# EasyEDA Pro project ProPrj_主板_2025-09-13.epro

# Schematic Schematic1
Board Name: Board1; Create Date: 2025-09-09; Page Name: P1; Project Name: 主板; Schematic Name: Schematic1; Update Date: 2025-09-12; Company: 嘉立创EDA; Page Size: A4; Version: V1.0
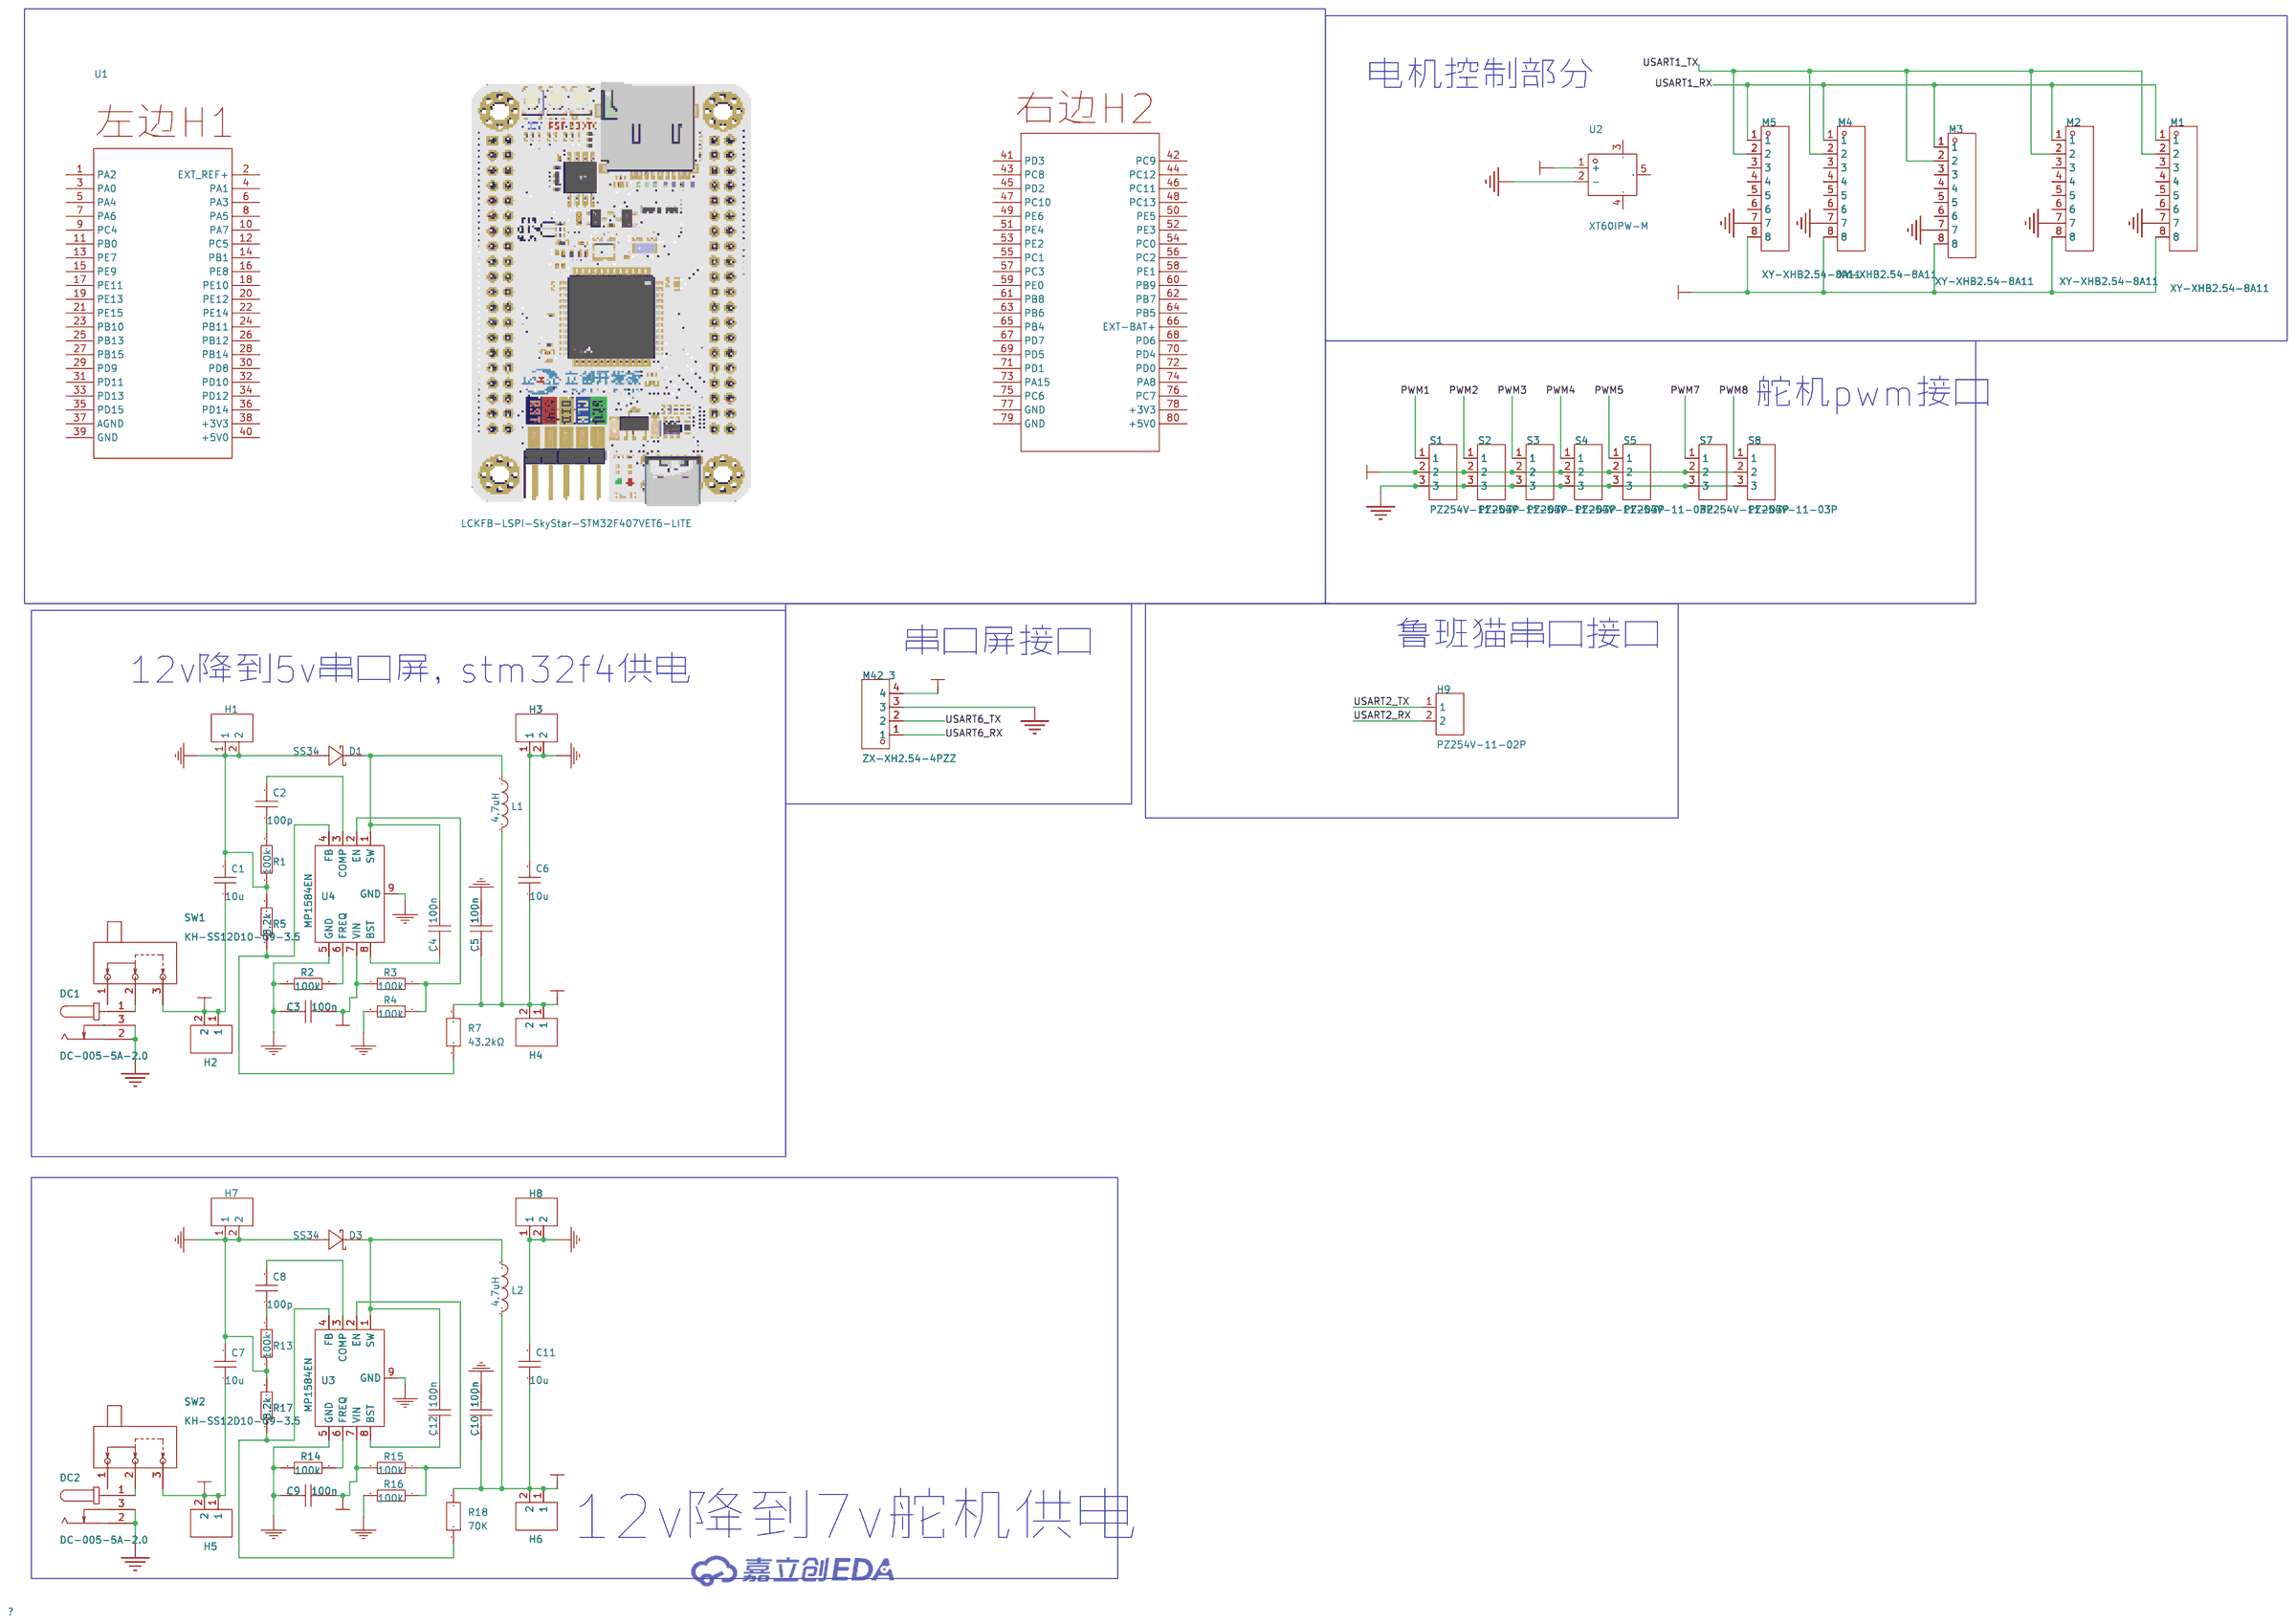
[diagram p0: schematic sheet]

## Parts
C1  10u  [C1206]
C2  100p  [C0603]
C3  100n  [C0603]
C4  100n  [C0603]
C5  100n  [C0603]
C6  10u  [C1206]
C7  10u  [C1206]
C8  100p  [C0603]
C9  100n  [C0603]
C10  100n  [C0603]
C11  10u  [C1206]
C12  100n  [C0603]
D1  SS34  [SMA_L4.2-W2.7-LS5.0-RD]
D3  SS34  [SMA_L4.2-W2.7-LS5.0-RD]
DC1  DC-005-5A-2.0  [DC-IN-TH_DC-005-5A-2.0]
DC2  DC-005-5A-2.0  [DC-IN-TH_DC-005-5A-2.0]
H1  KH-2.54PH180-1X2P-L11.5  [HDR-TH_2P-P2.54-V-M]
H2  KH-2.54PH180-1X2P-L11.5  [HDR-TH_2P-P2.54-V-M]
H3  KH-2.54PH180-1X2P-L11.5  [HDR-TH_2P-P2.54-V-M]
H4  KH-2.54PH180-1X2P-L11.5  [HDR-TH_2P-P2.54-V-M]
H5  KH-2.54PH180-1X2P-L11.5  [HDR-TH_2P-P2.54-V-M]
H6  KH-2.54PH180-1X2P-L11.5  [HDR-TH_2P-P2.54-V-M]
H7  KH-2.54PH180-1X2P-L11.5  [HDR-TH_2P-P2.54-V-M]
H8  KH-2.54PH180-1X2P-L11.5  [HDR-TH_2P-P2.54-V-M]
H9  PZ254V-11-02P  [HDR-TH_2P-P2.54-V-M]
L1  4.7uH  [IND-SMD_L6.0-W6.0_SLF6028T]
L2  4.7uH  [IND-SMD_L6.0-W6.0_SLF6028T]
M1  XY-XHB2.54-8A11  [HDR-TH_8P-P2.50-V-F-2]
M2  XY-XHB2.54-8A11  [HDR-TH_8P-P2.50-V-F-2]
M3  XY-XHB2.54-8A11  [HDR-TH_8P-P2.50-V-F-2]
M4  XY-XHB2.54-8A11  [HDR-TH_8P-P2.50-V-F-2]
M5  XY-XHB2.54-8A11  [HDR-TH_8P-P2.50-V-F-2]
M42_3  ZX-XH2.54-4PZZ  [CONN-TH_4P-P2.50_4PIN]
R1  100k  [R0603]
R2  100k  [R0603]
R3  100k  [R0603]
R4  100k  [R0603]
R5  8.2k  [R0603]
R7  43.2kΩ  [R0603]
R13  100k  [R0603]
R14  100k  [R0603]
R15  100k  [R0603]
R16  100k  [R0603]
R17  8.2k  [R0603]
R18  70K  [R0603]
S1  PZ254V-11-03P  [HDR-TH_3P-P2.54-V-M]
S2  PZ254V-11-03P  [HDR-TH_3P-P2.54-V-M]
S3  PZ254V-11-03P  [HDR-TH_3P-P2.54-V-M]
S4  PZ254V-11-03P  [HDR-TH_3P-P2.54-V-M]
S5  PZ254V-11-03P  [HDR-TH_3P-P2.54-V-M]
S7  PZ254V-11-03P  [HDR-TH_3P-P2.54-V-M]
S8  PZ254V-11-03P  [HDR-TH_3P-P2.54-V-M]
SW1  KH-SS12D10-G9-3.5  [SW-TH_KH-SS12D10-G9-3.5]
SW2  KH-SS12D10-G9-3.5  [SW-TH_KH-SS12D10-G9-3.5]
U1  LCKFB-LSPI-SkyStar-STM32F407VET6-LITE  [COMM-TH_LCKFB-LSPI-SKYSTAR-STM32F407VET6-LITE]
U2  XT60IPW-M  [XT60-TH_XT60IPW-M]
U3  MP1584EN  [SOIC-8_L4.9-W3.9-P1.27-LS6.0-BL-EP3.3]
U4  MP1584EN  [SOIC-8_L4.9-W3.9-P1.27-LS6.0-BL-EP3.3]

## Library data of the parts
C1 C6 C7 C11 = 10u: Supplier: LCSC; Manufacturer Part: CL31A106KBHNNNE; Manufacturer: SAMSUNG; Supplier Part: C13585; JLCPCB Part Class: Basic Part
C2 C8 = 100p: Supplier: LCSC; Manufacturer: FH; Manufacturer Part: 0603CG101J500NT; Supplier Part: C1635; JLCPCB Part Class: Extended Part
C3-C5 C9 C10 C12 = 100n: Supplier: LCSC; Manufacturer: YAGEO; Manufacturer Part: CC0603KRX7R9BB104; Supplier Part: C14663; JLCPCB Part Class: Basic Part
D1 D3 = SS34: Supplier: LCSC; Supplier Part: C2891718; Manufacturer: KUU; JLCPCB Part Class: Extended Part
DC1 DC2 = DC-005-5A-2.0: 连接器类型:DC电源插座;安装方式:弯插;触点内径:2mm;触点外径:6.2mm;额定电流:5A;额定电压:24V;工作温度范围:-20℃~+70℃;; LCSC Part Name: DC电源插座 内径:2mm 外径:6.2mm; Supplier Part: C381116; Manufacturer: XKB Connection(中国星坤); Supplier Footprint: 插件; JLCPCB Part Class: 扩展库; Datasheet: https://atta.szlcsc.com/upload/public/pdf/source/20211015/707A35F7AB6E89C57AAB641950105BB7.pdf; Supplier: LCSC; Connector Type: DC电源插座; Mounting Style: 弯插; Inside Contact Diameter: 2mm; Outside Contact Diameter: 6.2mm; Current Rating (Max): 5A; Voltage Rating (Max): 24V; Operating Temperature Range: -20℃~+70℃
H1-H8 = KH-2.54PH180-1X2P-L11.5: Supplier: LCSC; Supplier Part: C2905434; Manufacturer: kinghelm(金航标); JLCPCB Part Class: Extended Part
H9 = PZ254V-11-02P: 插针结构:1x2P;间距:2.54mm;行距:-;圆针/方针:方针;安装方式:直插;排数:单排;总PIN位数:2P;额定电流:-;额定电压:-;配合针长度:6mm;塑高:2.5mm;端接针长度:3mm;触头材质:黄铜;触头镀层:-;工作温度:-40℃~+105℃;颜色:黑色;; LCSC Part Name: 1x2P 间距:2.54mm 方针 直插; Supplier Part: C492401; Manufacturer: XFCN(兴飞); Supplier Footprint: 插件,P=2.54mm; JLCPCB Part Class: 扩展库; Datasheet: https://item.szlcsc.com/datasheet/PZ254V-11-02P/502957.html; Supplier: LCSC; Pin Structure: 1x2P; Pitch: 2.54mm; Circluar Pins/Square Pins: 方针; Mounting Type: 直插; Number of Rows: 单排; Number of Pins: 2P; Length of Mating Pin: 6mm; Insulation Height: 2.5mm; Length of End Connection Pin: 3mm; Contact Material: 黄铜; Operating Temperature: -40℃~+105℃; Color: 黑色
L1 L2 = 4.7uH: Supplier: LCSC; Supplier Part: C207840; Manufacturer: Sunltech Tech; Manufacturer Part: SLO0630H4R7MTT; JLCPCB Part Class: Extended Part
M1-M5 = XY-XHB2.54-8A11: 插针结构:1x8P;间距:2.54mm;安装方式:直插;总PIN数:8P;排数:1;每排PIN数:8;行距:2.54mm;额定电流:2A;工作温度范围:-25℃~+85℃;; LCSC Part Name: 1x8P 间距:2.54mm 直插; Supplier Part: C19271392; Manufacturer: XYECONN(辛译); Supplier Footprint: 插件,P=2.54mm; JLCPCB Part Class: Extended Part; Datasheet: https://atta.szlcsc.com/upload/public/pdf/source/20231124/C902967B562345BA8733710E2DCD4DF9.pdf; Supplier: LCSC; Pins Structure: 1x8P; Pitch: 2.54mm; Mounting Style: 直插; Number of Pins: 8P; Number of Rows: 1; Number of PINs Per Row: 8; Row Spacing: 2.54mm; Current Rating (Max): 2A; Operating Temperature Range: -25℃~+85℃
M42_3 = ZX-XH2.54-4PZZ: 插针结构:1x4P;间距:2.5mm;安装方式:直插;参考系列:XH;总PIN数:4P;排数:1;每排PIN数:4;行距:-;额定电流:3A;触头材质:黄铜;触头镀层:锡;工作温度范围:-25℃~+85℃;; LCSC Part Name: 1x4P 间距:2.5mm 直插 系列:XH; Supplier Part: C7429634; Manufacturer: Megastar(兆星); Supplier Footprint: 插件,P=2.5mm; JLCPCB Part Class: 扩展库; Datasheet: https://atta.szlcsc.com/upload/public/pdf/source/20230619/B529A2163E0159A644AB3383D208FB03.pdf; Supplier: LCSC; Pins Structure: 1x4P; Pitch: 2.5mm; Mounting Type: 直插; Reference Series: XH; Number of Pins: 4P; Number of Rows: 1; Number of PINs Per Row: 4; Rated Current: 3A; Contact Material: 黄铜; Contact Plating: 锡; Operating Temperature: -25℃~+85℃; Rated Voltage (Max): 250V; Plastic Material: PA66; Flame Retardant Rating: UL94V-0; Color: 白色; Z-Height of the Board: 7mm; X-Length of Bottom Edge on Board (Spacing Line): 12.5mm; Y-Width of Bottom Edge on Board: 5.9mm
R1-R4 R13-R16 = 100k: Supplier: LCSC; Manufacturer: UniOhm; Manufacturer Part: 0603WAF1003T5E; Supplier Part: C25803; Resistance: 100K; JLCPCB Part Class: Basic Part
R5 R17 = 8.2k: Supplier: LCSC; Manufacturer: UniOhm; Manufacturer Part: 0603WAF8201T5E; Supplier Part: C25981; Resistance: 8.2K; JLCPCB Part Class: Basic Part
R7 R18 = FRC0603F4322TS: 5V_1; LCSC Part Name: 43.2kΩ ±1% 100mW 厚膜电阻; Supplier Part: C2930102; Manufacturer: FOJAN(富捷); Supplier Footprint: 0603; JLCPCB Part Class: 扩展库; Datasheet: https://atta.szlcsc.com/upload/public/pdf/source/20211221/925EC7D7225764EE0046F22065062C87.pdf; Supplier: LCSC; Type: 厚膜电阻; Tolerance: ±1%; Power(Watts): 100mW; Overload Voltage (Max): 5V_1; Temperature Coefficient: ±100ppm/℃; Operating Temperature Range: -55℃~+155℃
S1-S5 S7 S8 = PZ254V-11-03P: 插针结构:1x3P;间距:2.54mm;行距:-;圆针/方针:方针;安装方式:直插;排数:单排;总PIN位数:3P;额定电流:3A;额定电压:250V;配合针长度:6mm;塑高:2.5mm;端接针长度:3mm;工作温度:-40℃~+105℃;颜色:黑色;; LCSC Part Name: 1x3P 间距:2.54mm 方针 直插; Supplier Part: C2937625; Manufacturer: XFCN(兴飞); Supplier Footprint: 插件,P=2.54mm; JLCPCB Part Class: 扩展库; Datasheet: https://atta.szlcsc.com/upload/public/pdf/source/20200309/C492402_8335C3D49C4E4C618838D59BB1D024C1.pdf; Supplier: LCSC; Pin Structure: 1x3P; Pitch: 2.54mm; Circluar Pins/Square Pins: 方针; Mounting Type: 直插; Number of Rows: 单排; Number of Pins: 3P; Current Rating: 3A; Voltage Rating (Max): 250V; Length of Mating Pin: 6mm; Insulation Height: 2.5mm; Length of End Connection Pin: 3mm; Operating Temperature: -40℃~+105℃; Color: 黑色
SW1 SW2 = KH-SS12D10-G9-3.5: LCSC Part Name: 拨动开关 KH-SS12D10-G9-3.5 针长3.5; Supplier Part: C5274458; Manufacturer: kinghelm(金航标); Supplier Footprint: 插件; JLCPCB Part Class: 扩展库; Datasheet: https://atta.szlcsc.com/upload/public/pdf/source/20221118/84F653834E486D193B24FCAB64F09D03.pdf; Supplier: LCSC
U1 = LCKFB-LSPI-SKYSTAR-STM32F407VET6-LITE: LCSC Part Name: 立创·天空星开发板-STM32F407VET6-青春版; Supplier Part: C22370035; Manufacturer: 立创开发板; JLCPCB Part Class: Extended Part; Datasheet: https://item.szlcsc.com/datasheet/LCKFB-LSPI-SkyStar-STM32F407VET6-LITE/23849165.html; Supplier: LCSC
U2 = XT60IPW-M: Supplier Part: C9900075941; Supplier Footprint: 连接器; Supplier: LCSC
U3 U4 = MP1584EN: Supplier: LCSC; Supplier Part: C454188; Manufacturer: null; JLCPCB Part Class: Extended Part

## Nets
5V_1: C5.1 C6.1 H4.1 H4.2 L1.2 R7.2
5V_2: M42_3.4
7V: C10.1 C11.1 H6.1 H6.2 L2.2 R18.2 S1.2 S2.2 S3.2 S4.2 S5.2 S7.2 S8.2
12V_1: C1.1 C3.2 H2.1 H2.2 M1.8 M2.8 M3.8 M4.8 M5.8 R3.2 SW1.3 U2.1(+) U4.7(VIN)
12V_2: C7.1 C9.2 H5.1 H5.2 R15.2 SW2.3 U3.7(VIN)
GND: C1.2 C3.1 C5.2 C6.2 C7.2 C9.1 C10.2 C11.2 D1.2(A) D3.2(A) DC1.2 DC1.3 DC2.2 DC2.3 H1.1 H1.2 H3.1 H3.2 H7.1 H7.2 H8.1 H8.2 M1.7 M2.7 M3.7 M4.7 M5.7 M42_3.3 R1.1 R2.2 R4.2 R5.2 R13.1 R14.2 R16.2 R17.2 S1.3 S2.3 S3.3 S4.3 S5.3 S7.3 S8.3 U2.2(-) U3.5(GND) U3.9(GND) U4.5(GND) U4.9(GND)
PWM1: S1.1
PWM2: S2.1
PWM3: S3.1
PWM4: S4.1
PWM5: S5.1
PWM7: S7.1
PWM8: S8.1
USART1_RX: M1.1 M2.1 M3.1 M4.1 M5.1
USART1_TX: M1.2 M2.2 M3.2 M4.2 M5.2
USART2_RX: H9.2
USART2_TX: H9.1
USART6_RX: M42_3.1
USART6_TX: M42_3.2
Net-(C2-1): C2.1 R1.2
Net-(C2-2): C2.2 U4.3(COMP)
Net-(C4-1): C4.1 U4.8(BST)
Net-(C4-2): C4.2 D1.1(K) L1.1 U4.1(SW)
Net-(C8-1): C8.1 R13.2
Net-(C8-2): C8.2 U3.3(COMP)
Net-(C12-1): C12.1 U3.8(BST)
Net-(C12-2): C12.2 D3.1(K) L2.1 U3.1(SW)
Net-(DC1-1): DC1.1 SW1.2
Net-(DC2-1): DC2.1 SW2.2
Net-(R2-1): R2.1 U4.6(FREQ)
Net-(R3-1): R3.1 R4.1 U4.2(EN)
Net-(R5-1): R5.1 R7.1 U4.4(FB)
Net-(R14-1): R14.1 U3.6(FREQ)
Net-(R15-1): R15.1 R16.1 U3.2(EN)
Net-(R17-1): R17.1 R18.1 U3.4(FB)

Not connected (* = marked no-connect by the designer): M1 3 4 5 6; M2 3 4 5 6; M3 3 4 5 6; M4 3 4 5 6; M5 3 4 5 6; SW1 1; SW2 1; U1 1(PA2) 2(EXT REF+) 3(PA0) 4(PA1) 5(PA4) 6(PA3) 7(PA6) 8(PA5) 9(PC4) 10(PA7) 11(PB0) 12(PC5) 13(PE7) 14(PB1) 15(PE9) 16(PE8) 17(PE11) 18(PE10) 19(PE13) 20(PE12) 21(PE15) 22(PE14) 23(PB10) 24(PB11) 25(PB13) 26(PB12) 27(PB15) 28(PB14) 29(PD9) 30(PD8) 31(PD11) 32(PD10) 33(PD13) 34(PD12) 35(PD15) 36(PD14) 37(AGND) 38(+3V3) 39(GND) 40(+5V0) 41(PD3) 42(PC9) 43(PC8) 44(PC12) 45(PD2) 46(PC11) 47(PC10) 48(PC13) 49(PE6) 50(PE5) 51(PE4) 52(PE3) 53(PE2) 54(PC0) 55(PC1) 56(PC2) 57(PC3) 58(PE1) 59(PE0) 60(PB9) 61(PB8) 62(PB7) 63(PB6) 64(PB5) 65(PB4) 66(EXT-BAT+) 67(PD7) 68(PD6) 69(PD5) 70(PD4) 71(PD1) 72(PD0) 73(PA15) 74(PA8) 75(PC6) 76(PC7) 77(GND) 78(+3V3) 79(GND) 80(+5V0); U2 3(NC) 4(NC) 5(NC)

## Notes on the sheet
- 电机控制部分
- 舵机pwm接口
- 鲁班猫串口接口
- 串口屏接口
- 12v降到5v串口屏，stm32f4供电
- 12v降到7v舵机供电
